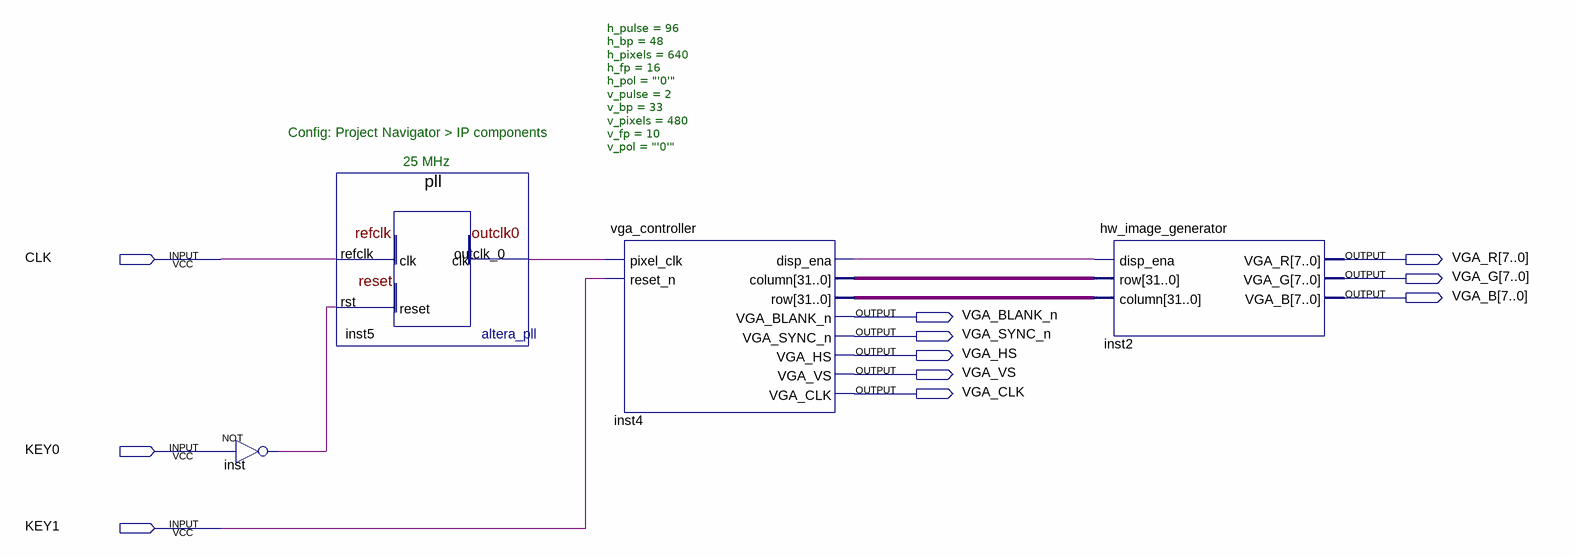
[diagram p0: schematic sheet]
// Quartus schematic main.bdf as structural Verilog: 4 symbols, 11 pins
module main (
  input  CLK,
  input  KEY0,
  input  KEY1,
  output [7:0] VGA_R,
  output [7:0] VGA_G,
  output [7:0] VGA_B,
  output VGA_BLANK_n,
  output VGA_SYNC_n,
  output VGA_HS,
  output VGA_VS,
  output VGA_CLK
);

  wire inst4_disp_ena, inst5_outclk_0, inst_out;
  wire [31:0] inst4_column, inst4_row;

  not inst (inst_out, KEY0);
  pll inst5 (.refclk(CLK), .rst(inst_out), .outclk_0(inst5_outclk_0));
  vga_controller #(.h_pulse(96), .h_bp(48), .h_pixels(640), .h_fp(16), .h_pol("'0'"), .v_pulse(2), .v_bp(33), .v_pixels(480), .v_fp(10), .v_pol("'0'")) inst4 (
    .pixel_clk(inst5_outclk_0), .reset_n(KEY1), .disp_ena(inst4_disp_ena), .column(inst4_column),
    .row(inst4_row), .VGA_BLANK_n(VGA_BLANK_n), .VGA_SYNC_n(VGA_SYNC_n), .VGA_HS(VGA_HS), .VGA_VS(VGA_VS),
    .VGA_CLK(VGA_CLK));
  hw_image_generator inst2 (
    .disp_ena(inst4_disp_ena), .row(inst4_column), .column(inst4_row), .VGA_R(VGA_R), .VGA_G(VGA_G),
    .VGA_B(VGA_B));

  // Notes on the sheet:
  //   Config: Project Navigator > IP components 
  //   25 MHz
endmodule
